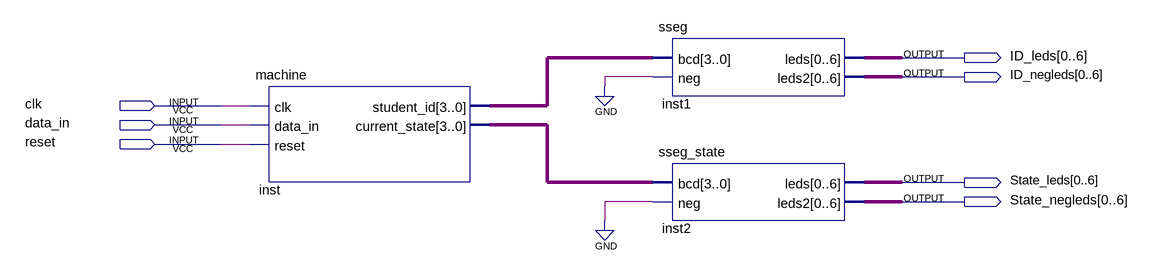
[diagram p0: schematic sheet]
// Quartus schematic StateMachine.bdf as structural Verilog: 3 symbols, 7 pins
module StateMachine (
  input  clk,
  input  data_in,
  input  reset,
  output [0:6] ID_leds,
  output [0:6] ID_negleds,
  output [0:6] State_leds,
  output [0:6] State_negleds
);

  wire [3:0] inst_current_state, inst_student_id;

  machine inst (
    .clk(clk), .data_in(data_in), .reset(reset), .student_id(inst_student_id),
    .current_state(inst_current_state));
  sseg inst1 (.bcd(inst_student_id), .neg(1'b0), .leds(ID_leds), .leds2(ID_negleds));
  sseg_state inst2 (.bcd(inst_current_state), .neg(1'b0), .leds(State_leds), .leds2(State_negleds));
endmodule
